# EasyEDA Pro project ProPrj_FOC12_2025-04-03.epro, schematic Schematic2
Board Name: 控制板; Create Date: 2024-12-24; Page Name: P1; Project Name: FOC12; Schematic Name: Schematic2; Update Date: 2025-03-12; Company: 嘉立创EDA; Drawed: Solituder; Page Size: A4; Version: V4.0
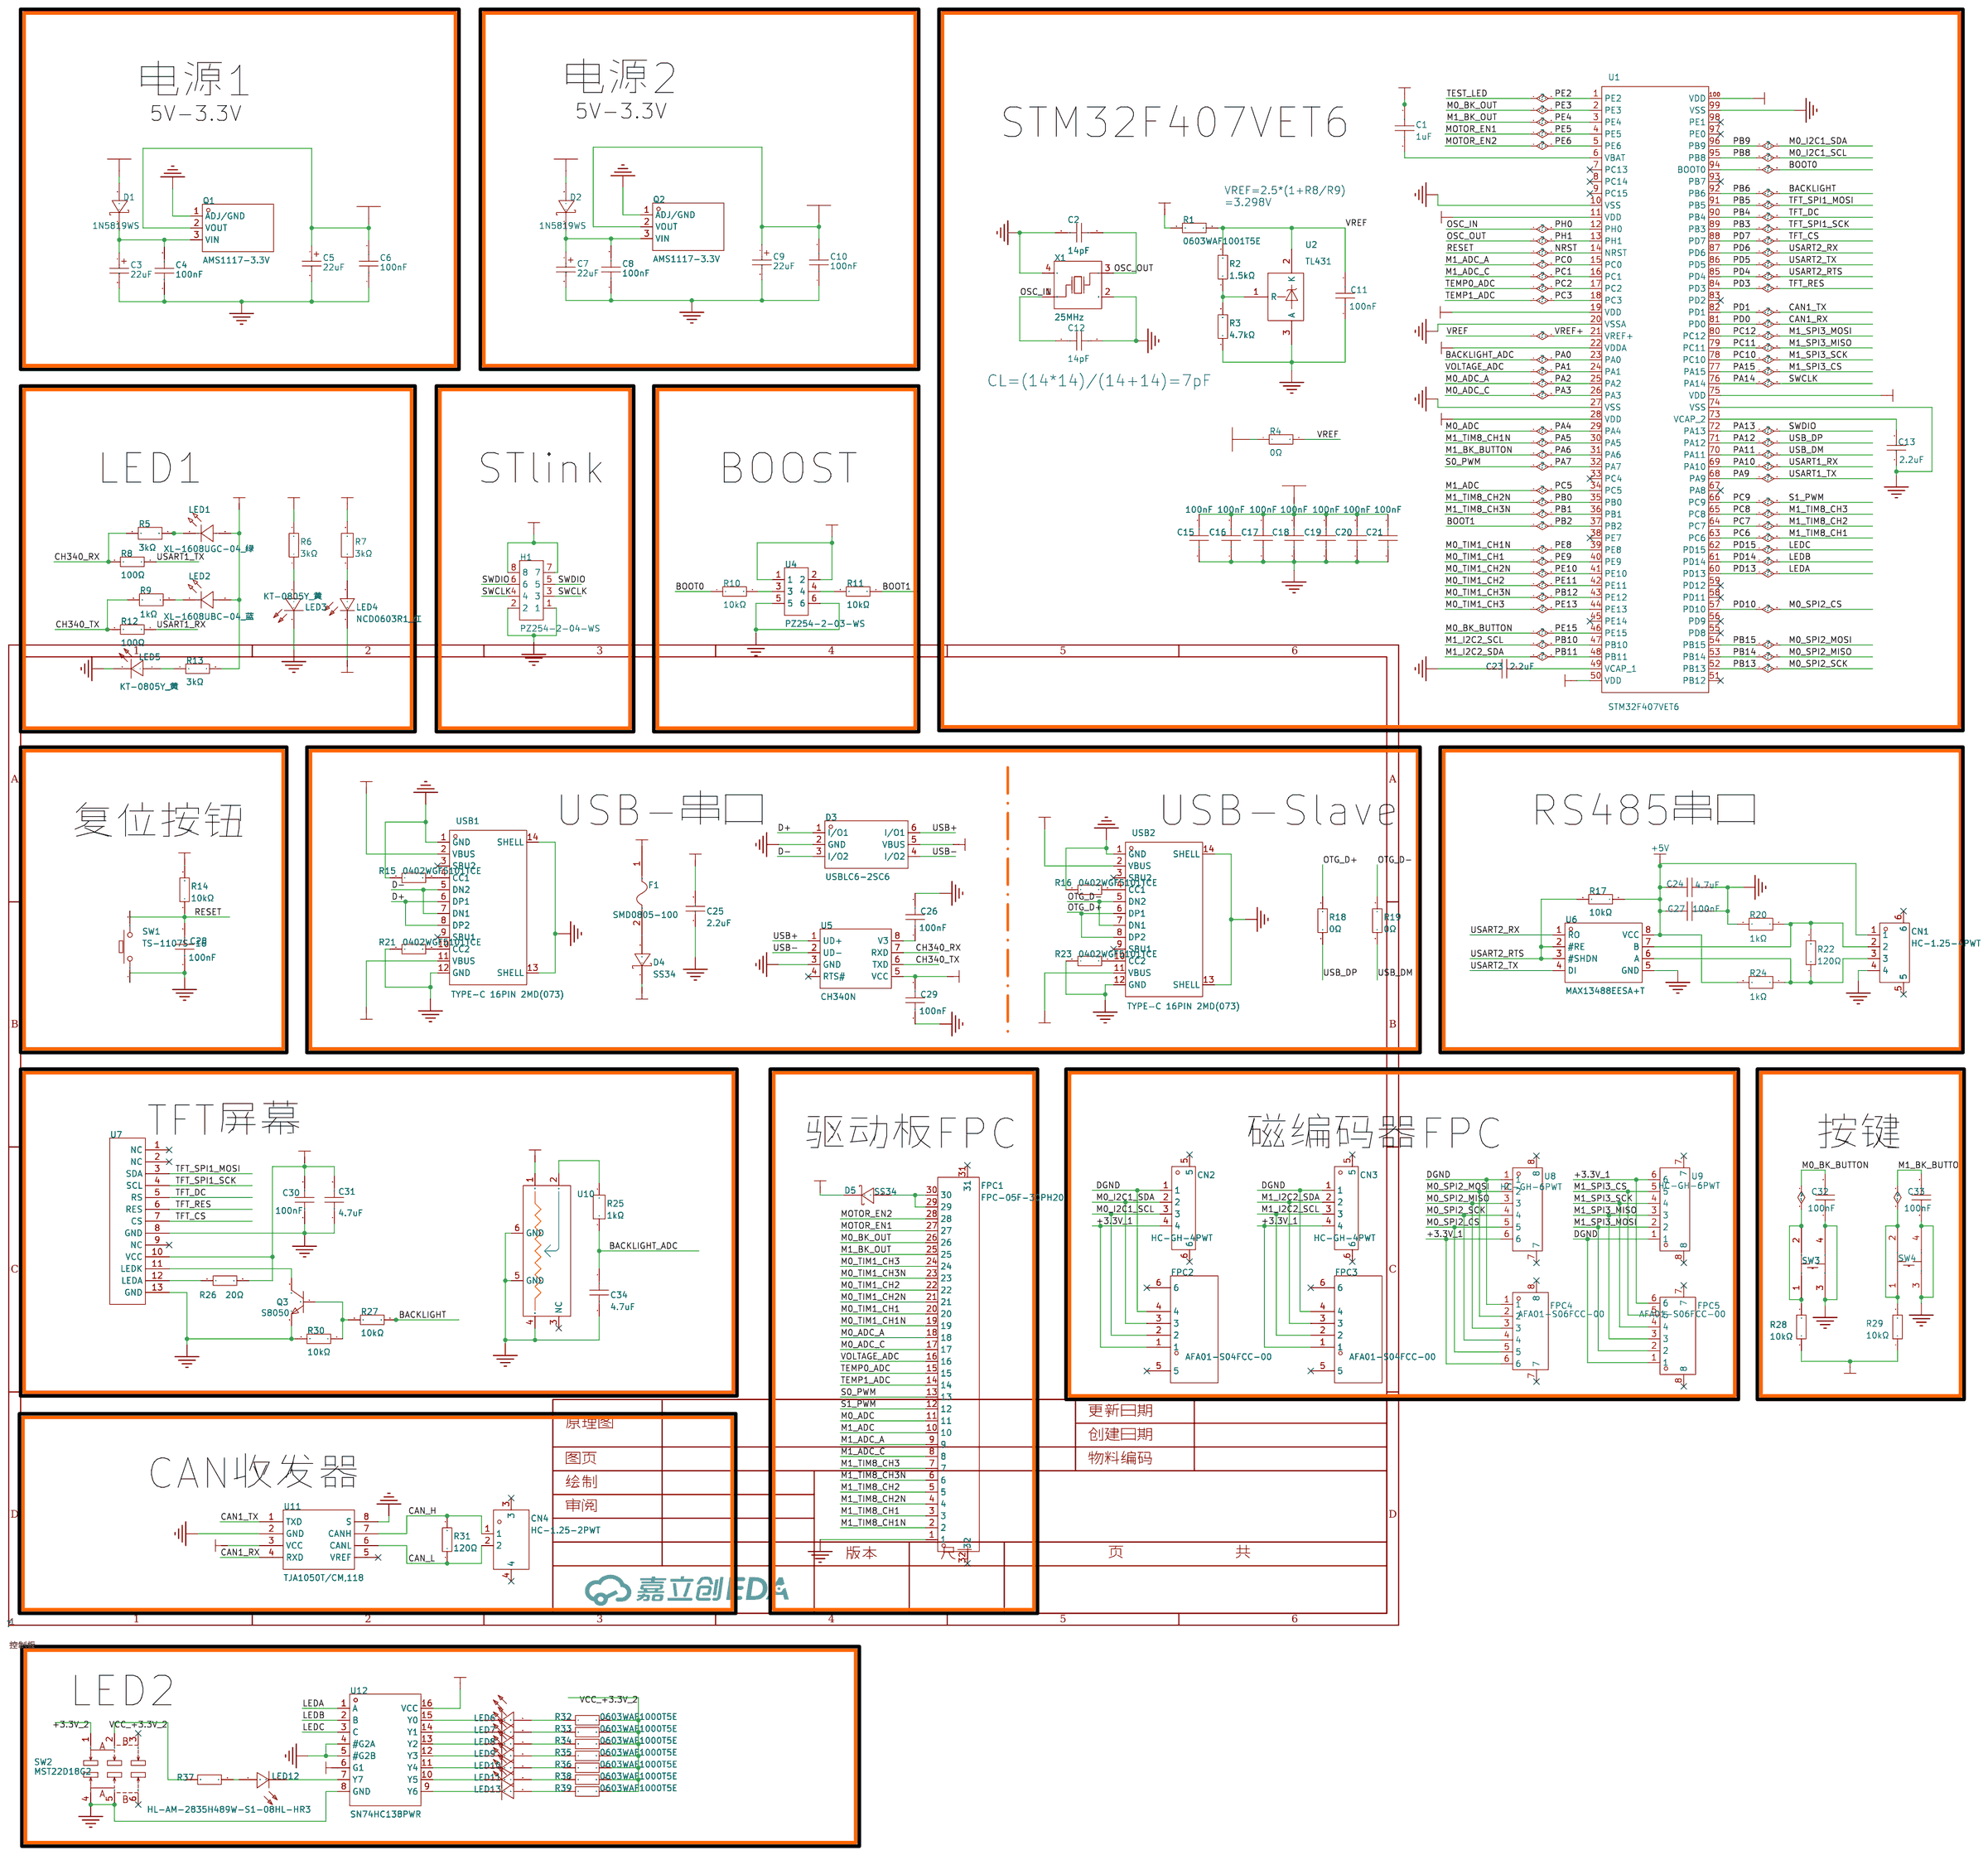
[diagram p1: schematic sheet]

## Parts
C1  1uF  [C0603]
C2  14pF  [C0402]
C3  22uF  [CASE-A_3216]
C4  100nF  [C0603]
C5  22uF  [CASE-A_3216]
C6  100nF  [C0603]
C7  22uF  [CASE-A_3216]
C8  100nF  [C0603]
C9  22uF  [CASE-A_3216]
C10  100nF  [C0603]
C11  100nF  [C0603]
C12  14pF  [C0402]
C13  2.2uF  [C0603]
C15  100nF  [C0603]
C16  100nF  [C0603]
C17  100nF  [C0603]
C18  100nF  [C0603]
C19  100nF  [C0603]
C20  100nF  [C0603]
C21  100nF  [C0603]
C23  2.2uF  [C0603]
C24  4.7uF  [C0603]
C25  2.2uF  [C0603]
C26  100nF  [C0603]
C27  100nF  [C0603]
C28  100nF  [C0603]
C29  100nF  [C0603]
C30  100nF  [C0603]
C31  4.7uF  [C0603]
C32  100nF  [C0603]
C33  100nF  [C0603]
C34  4.7uF  [C0603]
CN1  HC-1.25-4PWT  [CONN-SMD_4P-P1.25-HC-1.25-4PWT]
CN2  HC-GH-4PWT  [CONN-SMD_HC-GH-4PWT]
CN3  HC-GH-4PWT  [CONN-SMD_HC-GH-4PWT]
CN4  HC-1.25-2PWT  [CONN-SMD_2P-P1.25-HC-1.25-2PWT]
D1  1N5819WS  [SOD-323_L1.8-W1.3-LS2.5-RD]
D2  1N5819WS  [SOD-323_L1.8-W1.3-LS2.5-RD]
D3  USBLC6-2SC6  [SOT-23-6_L2.9-W1.6-P0.95-LS2.8-BL]
D4  SS34  [SMA_L4.3-W2.6-LS5.2-RD]
D5  SS34  [SMA_L4.3-W2.6-LS5.2-RD]
F1  SMD0805-100  [F0805]
FPC1  FPC-05F-30PH20  [FPC-SMD_30P-P0.50_XUNPU_FPC-05F-30PH20]
FPC2  AFA01-S04FCC-00  [FPC-SMD_AFA01-S04FCC-00]
FPC3  AFA01-S04FCC-00  [FPC-SMD_AFA01-S04FCC-00]
FPC4  AFA01-S06FCC-00  [FPC-SMD_6P-P1.00_AFA01-S06]
FPC5  AFA01-S06FCC-00  [FPC-SMD_6P-P1.00_AFA01-S06]
H1  PZ254-2-04-WS  [HDR-SMD_8P-P2.54-H-M-R2-C4_2]
LED1  XL-1608UGC-04_绿  [LED0603-RD_GREEN]
LED2  XL-1608UBC-04_蓝  [LED0603-RD_BLUE]
LED3  KT-0805Y_黄  [LED0805-R-RD]
LED4  NCD0603R1_红  [LED0603-RD_RED]
LED5  KT-0805Y_黄  [LED0805-R-RD]
LED6  HL-AM-2835H489W-S1-08HL-HR3  [LED-SMD_L3.3-W2.8-RD]
LED7  HL-AM-2835H489W-S1-08HL-HR3  [LED-SMD_L3.3-W2.8-RD]
LED8  HL-AM-2835H489W-S1-08HL-HR3  [LED-SMD_L3.3-W2.8-RD]
LED9  HL-AM-2835H489W-S1-08HL-HR3  [LED-SMD_L3.3-W2.8-RD]
LED10  HL-AM-2835H489W-S1-08HL-HR3  [LED-SMD_L3.3-W2.8-RD]
LED11  HL-AM-2835H489W-S1-08HL-HR3  [LED-SMD_L3.3-W2.8-RD]
LED12  HL-AM-2835H489W-S1-08HL-HR3  [LED-SMD_L3.3-W2.8-RD]
LED13  HL-AM-2835H489W-S1-08HL-HR3  [LED-SMD_L3.3-W2.8-RD]
Q1  AMS1117-3.3V  [SOT-89-3_L4.5-W2.5-P1.50-LS4.2-BR]
Q2  AMS1117-3.3V  [SOT-89-3_L4.5-W2.5-P1.50-LS4.2-BR]
Q3  S8050  [SOT-23-3_L2.9-W1.3-P1.90-LS2.4-BR]
R1  0603WAF1001T5E  [R0603]
R2  1.5kΩ  [R0603]
R3  4.7kΩ  [R0603]
R4  0Ω  [R0603]
R5  3kΩ  [R0402]
R6  3kΩ  [R0603]
R7  3kΩ  [R0402]
R8  100Ω  [R0402]
R9  1kΩ  [R0402]
R10  10kΩ  [R0402]
R11  10kΩ  [R0402]
R12  100Ω  [R0402]
R13  3kΩ  [R0603]
R14  10kΩ  [R0402]
R15  0402WGF5101TCE  [R0402]
R16  0402WGF5101TCE  [R0402]
R17  10kΩ  [R0402]
R18  0Ω  [R0603]
R19  0Ω  [R0603]
R20  1kΩ  [R0402]
R21  0402WGF5101TCE  [R0402]
R22  120Ω  [R0603]
R23  0402WGF5101TCE  [R0402]
R24  1kΩ  [R0402]
R25  1kΩ  [R0402]
R26  20Ω  [R0402]
R27  10kΩ  [R0402]
R28  10kΩ  [R0402]
R29  10kΩ  [R0402]
R30  10kΩ  [R0402]
R31  120Ω  [R0603]
R32  0603WAF1000T5E  [R0603]
R33  0603WAF1000T5E  [R0603]
R34  0603WAF1000T5E  [R0603]
R35  0603WAF1000T5E  [R0603]
R36  0603WAF1000T5E  [R0603]
R37  0603WAF1000T5E  [R0603]
R38  0603WAF1000T5E  [R0603]
R39  0603WAF1000T5E  [R0603]
SW1  TS-1107S-16  [SW-SMD_L6.0-W3.7-LS8.0]
SW2  MST22D18G2  [SW-SMD_MST22D18G2]
SW3  K2-1808SN-A3SW-01  [椭圆白头按钮开关]
SW4  K2-1808SN-A3SW-01  [椭圆白头按钮开关]
U1  STM32F407VET6  [LQFP-100_L14.0-W14.0-P0.50-LS16.0-BL]
U2  TL431  [SOT-23-3_L2.9-W1.4-P1.90-LS2.6-BR]
U4  PZ254-2-03-WS  [HDR-SMD_6P-P2.54-H-M-R2-C3-LS17.0]
U5  CH340N  [SOP-8_L4.9-W3.9-P1.27-LS6.0-BL]
U6  MAX13488EESA+T  [SOIC-8_L5.0-W4.0-P1.27-LS6.0-BL]
U7  -  [1.14 TFT_13P]
U8  HC-GH-6PWT  [CONN-SMD_6P-P1.25_HCTL_HC-GH-6PWT]
U9  HC-GH-6PWT  [CONN-SMD_6P-P1.25_HCTL_HC-GH-6PWT]
U10  -  [RS08U111Z001]
U11  TJA1050T/CM,118  [SOIC-8_L5.0-W4.0-P1.27-LS6.0-BL]
U12  SN74HC138PWR  [TSSOP-16_L5.0-W4.4-P0.65-LS6.4-BL]
USB1  TYPE-C 16PIN 2MD(073)  [USB-C-SMD_TYPE-C-6PIN-2MD-073]
USB2  TYPE-C 16PIN 2MD(073)  [USB-C-SMD_TYPE-C-6PIN-2MD-073]
X1  25MHz  [CRYSTAL-SMD_4P-L3.2-W2.5-BL]

## Library data of the parts
C1 = CL10A105KB8NNNC: 温度系数:X5R;精度:±10%;额定电压:50V;容值:1uF;; LCSC Part Name: 1uF(105) ±10% 50V; Supplier Part: C15849; Manufacturer: SAMSUNG(三星); Supplier Footprint: 0603; JLCPCB Part Class: Basic Part; Datasheet: https://atta.szlcsc.com/upload/public/pdf/source/20160103/1457707679084.pdf; Supplier: LCSC; Tolerance: ±10%; Voltage Rated: 50V; Temperature Coefficient: X5R
C2 C12 = 0402CG140J500NT: 容值:14pF;精度:±5%;额定电压:50V;材质(温度系数):C0G;; LCSC Part Name: 14pF ±5% 50V; Supplier Part: C3037644; Manufacturer: FH(风华); Supplier Footprint: 0402; JLCPCB Part Class: 扩展库; Datasheet: https://atta.szlcsc.com/upload/public/pdf/source/20200305/C486355_26A10D38EF8C2A5C37091D0039909270.pdf; Supplier: LCSC; Tolerance: ±5%; Voltage Rated: 50V; Temperature Coefficient: C0G
C3 C5 C7 C9 = TAJA226K010RNJ: 容值:22uF;精度:±10%;额定电压:10V;等效串联电阻:3Ω@100kHz;; LCSC Part Name: 22uF ±10% 10V; Supplier Part: C11366; Manufacturer: Kyocera AVX; Supplier Footprint: CASE-A-3216; JLCPCB Part Class: Extended Part; Datasheet: https://atta.szlcsc.com/upload/public/pdf/source/20160107/1457707750344.pdf; Supplier: LCSC; Tolerance: ±10%; Rated Voltage: 10V; Equivalent Series Resistance(ESR): 3Ω@100kHz; Operating Temperature: -55℃~+125℃
C4 C6 C8 C10 C30 = CC0603KRX7R9BB104: 容值:100nF;精度:±10%;额定电压:50V;材质(温度系数):X7R;; LCSC Part Name: 100nF ±10% 50V; Supplier Part: C14663; Manufacturer: YAGEO(国巨); Supplier Footprint: 0603; Datasheet: https://atta.szlcsc.com/upload/public/pdf/source/20170116/1484561234239.pdf; Supplier: LCSC; Tolerance: ±10%; Voltage Rated: 50V; Temperature Coefficient: X7R
C11 C15-C21 C26-C29 C32 C33 = CGA0603X7R104K500JT: 容值:100nF;精度:±10%;额定电压:50V;材质(温度系数):X7R;; LCSC Part Name: 100nF ±10% 50V; Supplier Part: C6119867; Manufacturer: HRE(芯声); Supplier Footprint: 0603; Supplier: LCSC; Tolerance: ±10%; Voltage Rated: 50V; Temperature Coefficient: X7R
C13 C23 C25 = CL10A225KO8NNNC: 温度系数:X5R;容值:2.2uF;精度:±10%;额定电压:16V;; LCSC Part Name: 2.2uF(225) ±10% 16V; Supplier Part: C23630; Manufacturer: SAMSUNG(三星); Supplier Footprint: 0603; JLCPCB Part Class: Basic Part; Datasheet: https://atta.szlcsc.com/upload/public/pdf/source/20160103/1457707709512.pdf; Supplier: LCSC; Tolerance: ±10%; Voltage Rated: 16V; Temperature Coefficient: X5R
C24 C31 C34 = CL10A475KO8NNNC: 容值:4.7uF;精度:±10%;额定电压:16V;材质(温度系数):X5R;; LCSC Part Name: 4.7uF ±10% 16V; Supplier Part: C19666; Manufacturer: SAMSUNG(三星); Supplier Footprint: 0603; JLCPCB Part Class: Basic Part; Datasheet: https://atta.szlcsc.com/upload/public/pdf/source/20160103/1457707703134.pdf; Supplier: LCSC; Tolerance: ±10%; Voltage Rated: 16V; Temperature Coefficient: X5R
CN1 = HC-1.25-4PWT: 插针结构:1x4P;间距:1.25mm;安装方式:卧贴;参考系列:PicoBlade(MX 1.25);总PIN数:4P;排数:1;每排PIN数:4;行距:-;额定电流:1A;触头材质:黄铜;触头镀层:锡;工作温度范围:-40℃~+105℃;; LCSC Part Name: 1x4P 间距:1.25mm 卧贴 系列:PicoBlade(MX 1.25); Supplier Part: C2845381; Manufacturer: HCTL(华灿天禄); Supplier Footprint: SMD,P=1.25mm,卧贴; JLCPCB Part Class: 扩展库; Datasheet: https://atta.szlcsc.com/upload/public/pdf/source/20240930/9508A8292CCC87B0C29E3A028D56E30A.pdf; Supplier: LCSC; Pins Structure: 1x4P; Pitch: 1.25mm; Mounting Style: 卧贴; Reference Series: PicoBlade(MX 1.25); Number of Pins: 4P; Number of Rows: 1; Number of PINs Per Row: 4; Current Rating (Max): 1A; Contact Material: 黄铜; Contact Plating: 锡; Operating Temperature Range: -40℃~+105℃; Rated Voltage (Max): 125V; Plastic Material: LCP; Flame Retardant Rating: UL94V-0; Supplementary Features: 辅助焊脚; Z-Height of the Board: 3.57mm; X-Length of Bottom Edge on Board (Spacing Line): 10.05mm; Y-Width of Bottom Edge on Board: 5.25mm
CN2 CN3 = HC-GH-4PWT_C2845399: 插针结构:1x4P;间距:1.25mm;安装方式:卧贴;参考系列:GH;总PIN数:4P;排数:1;每排PIN数:4;行距:-;额定电流:1A;触头材质:磷青铜;触头镀层:锡;工作温度范围:-25℃~+85℃;; LCSC Part Name: 1x4P 间距:1.25mm 卧贴 系列:GH; Supplier Part: C2845399; Manufacturer: HCTL(华灿天禄); Supplier Footprint: SMD,P=1.25mm,卧贴; JLCPCB Part Class: 扩展库; Datasheet: https://atta.szlcsc.com/upload/public/pdf/source/20231019/68551EBC7AE35D3AC54804DC204EA813.pdf; Supplier: LCSC; Pins Structure: 1x4P; Pitch: 1.25mm; Mounting Style: 卧贴; Reference Series: GH; Number of Pins: 4P; Number of Rows: 1; Number of PINs Per Row: 4; Current Rating (Max): 1A; Contact Material: 磷青铜; Contact Plating: 锡; Operating Temperature Range: -25℃~+85℃; Rated Voltage (Max): 50V; Plastic Material: LCP; Flame Retardant Rating: UL94V-0; Supplementary Features: 辅助焊脚; Z-Height of the Board: 4.25mm; X-Length of Bottom Edge on Board (Spacing Line): 8.25mm
CN4 = HC-1.25-2PWT: 插针结构:1x2P;间距:1.25mm;安装方式:卧贴;参考系列:PicoBlade(MX 1.25);总PIN数:2P;排数:1;每排PIN数:2;行距:-;额定电流:1A;触头材质:黄铜;触头镀层:锡;工作温度范围:-40℃~+105℃;; LCSC Part Name: 1x2P 间距:1.25mm 卧贴 系列:PicoBlade(MX 1.25); Supplier Part: C2845379; Manufacturer: HCTL(华灿天禄); Supplier Footprint: SMD,P=1.25mm,卧贴; JLCPCB Part Class: 扩展库; Datasheet: https://atta.szlcsc.com/upload/public/pdf/source/20240930/9508A8292CCC87B0C29E3A028D56E30A.pdf; Supplier: LCSC; Pins Structure: 1x2P; Pitch: 1.25mm; Mounting Style: 卧贴; Reference Series: PicoBlade(MX 1.25); Number of Pins: 2P; Number of Rows: 1; Number of PINs Per Row: 2; Current Rating (Max): 1A; Contact Material: 黄铜; Contact Plating: 锡; Operating Temperature Range: -40℃~+105℃; Rated Voltage (Max): 125V; Plastic Material: LCP; Flame Retardant Rating: UL94V-0; Supplementary Features: 辅助焊脚; Z-Height of the Board: 3.57mm; X-Length of Bottom Edge on Board (Spacing Line): 7.55mm; Y-Width of Bottom Edge on Board: 5.25mm
D1 D2 = 1N5819WS_C191023: 直流反向耐压(Vr):40V;平均整流电流(Io):1A;正向压降(Vf):600mV@1A;; LCSC Part Name: 40V 1A 600mV@1A; Supplier Part: C191023; Manufacturer: Hottech(合科泰); Supplier Footprint: SOD-323; Datasheet: https://atta.szlcsc.com/upload/public/pdf/source/20180614/C191023_3C6A6398B911F3A4C23E7538EE054643.pdf; Supplier: LCSC; Reverse Voltage (Vr): 40V; Average Rectified Current (Io): 1A; Forward Voltage (Vf@If): 600mV@1A
D3 = USBLC6-2SC6: 最大钳位电压:15V;击穿电压:6V;; Supplier Part: C2687116; Manufacturer: UMW(友台半导体); Supplier Footprint: SOT-23-6; JLCPCB Part Class: 扩展库; Datasheet: https://atta.szlcsc.com/upload/public/pdf/source/20231109/512642D850D9873E7C519F71E85B9A10.pdf; Supplier: LCSC; Maximum Clamping Voltage: 15V; Breakdown Voltage: 6V; Number of Lines: 双路; Type: ESD
D4 D5 = SS34_C8678: 二极管配置:独立式;正向压降(Vf):550mV@3A;直流反向耐压(Vr):40V;整流电流:3A;; LCSC Part Name: 电压:40V 电流:3A; Supplier Part: C8678; Manufacturer: MDD(辰达半导体); Supplier Footprint: SMA(DO-214AC); JLCPCB Part Class: 基础库; Datasheet: https://atta.szlcsc.com/upload/public/pdf/source/20230314/A80AE34493C69B89E2F4B1712F433538.pdf; Supplier: LCSC; Diode Configuration: 独立式; Forward Voltage (Vf@If): 550mV@3A; Reverse Voltage (Vr): 40V; Rectified Current: 3A; Reverse Leakage Current (Ir): 500uA@40V
F1 = SMD0805-100: 最大电压:6V;最大电流:100A;保持电流:1A;跳闸电流:1.95A;; LCSC Part Name: 1A  6V 自恢复保险丝; Supplier Part: C70061; Manufacturer: 台湾陆海; Supplier Footprint: 0805; JLCPCB Part Class: Extended Part; Datasheet: https://atta.szlcsc.com/upload/public/pdf/source/20160331/1459396375879.pdf; Supplier: LCSC; Operating Voltage (Max): 6V; Current Rating (Max): 100A; Hold Current: 1A; Trip Current: 1.95A
FPC1 = FPC-05F-30PH20: 锁定特性:翻盖式;触点类型:下接;触点数量:30P;间距:0.5mm;安装类型:卧贴;工作温度范围:-25℃~+85℃;; LCSC Part Name: 间距:0.5mm P数:30P 翻盖式 下接; Supplier Part: C2856808; Manufacturer: XUNPU(讯普); Supplier Footprint: SMD,P=0.5mm,卧贴; JLCPCB Part Class: 扩展库; Datasheet: https://atta.szlcsc.com/upload/public/pdf/source/20210922/C2856808_4E6DDE2793CFD9EF09B771A8BD3338A4.pdf; Supplier: LCSC; Locking Feature: 翻盖式; Contact Type: 下接; Number of Contacts: 30P; Pitch: 0.5mm; Mounting Type: 卧贴; FFC, FCB Thickness: 0.3mm; Height Above Board: 2mm; Operating Temperature Range: -25℃~+85℃
FPC2 FPC3 = AFA01-S04FCC-00: 间距:1mm;触点数量:4;锁定特性:翻盖式;安装类型:卧贴;触点类型:下接;; LCSC Part Name: 1mm P数:4 翻盖式 下接; Supplier Part: C262381; Manufacturer: JS(钜硕电子); Supplier Footprint: SMD,P=1mm; Datasheet: https://atta.szlcsc.com/upload/public/pdf/source/20180810/C262381_0846EB3FDC52B56B2A83F750690C3963.pdf; Supplier: LCSC; Pitch: 1mm; Number of Contacts: 4; Locking Feature: 翻盖式; Mounting Type: 卧贴; Contact Type: 下接; Height Above Board: 2mm; FFC, FCB Thickness: 0.3mm
FPC4 FPC5 = AFA01-S06FCC-00: 间距:1mm;触点数量:6;锁定特性:翻盖式;安装类型:卧贴;触点类型:下接;; LCSC Part Name: 1mm P数:6 翻盖式 下接; Supplier Part: C262383; Manufacturer: JS(钜硕电子); Supplier Footprint: SMD,P=1mm; JLCPCB Part Class: Extended Part; Datasheet: https://atta.szlcsc.com/upload/public/pdf/source/20180814/C262383_CF97819C579FC3B5207D9C4D84E357C3.pdf; Supplier: LCSC; Locking Feature: 翻盖式; Contact Type: 下接; Number of Contacts: 6; Pitch: 1mm; Mounting Type: 卧贴; FFC, FCB Thickness: 0.3mm; Height Above Board: 2mm
H1 = PZ254-2-04-WS: 插针结构:2x4P;间距:2.54mm;行距:2.54mm;圆针/方针:方针;安装类型:卧贴;排数:双排;总PIN位数:8P;额定电流:3A;额定电压:-;配合针长度:6mm;塑高:2.5mm;端接针长度:-;工作温度范围:-40℃~+105℃;焊接温度(最大值):260℃@10S;颜色:黑色;; LCSC Part Name: 2x4P 间距:2.54mm 方针 卧贴 黑色; Supplier Part: C5149354; Manufacturer: HCTL(华灿天禄); Supplier Footprint: SMD,P=2.54mm; JLCPCB Part Class: 扩展库; Datasheet: https://atta.szlcsc.com/upload/public/pdf/source/20230609/395CF6299CB3DEE695290492722C7F5B.pdf; Supplier: LCSC; Pin Structure: 2x4P; Pitch: 2.54mm; Row Spacing: 2.54mm; Circluar Pins/Square Pins: 方针; Mounting Type: 卧贴; Number of Rows: 双排; Number of Pins: 8P; Current Rating (Max): 3A; Length of Mating Pin: 6mm; Insulation Height: 2.5mm; Operating Temperature Range: -40℃~+105℃; Soldering Temperature(Max): 260℃@10S; Color: 黑色
LED1 = XL-1608UGC-04: 灯头类型:-;发光颜色:翠绿色;正向电压(VF):-;功率:80mW;正向电流:25mA;主波长:516nm~525nm;二极管配置:独立二极管;透镜颜色:无色透明透镜;色温:-;发光强度:-;发光角度:120°;载带方式:正贴;工作温度:-30℃~+85℃;; Supplier Part: C965804; Manufacturer: XINGLIGHT(成兴光); Supplier Footprint: 0603; JLCPCB Part Class: 扩展库; Datasheet: https://atta.szlcsc.com/upload/public/pdf/source/20221102/520D6E465E5CFD1609C8A4DBC80D4018.pdf; Supplier: LCSC; Emitted Color: 翠绿色; Power Dissipation: 80mW; Forward Current: 25mA; Dominant Wavelength: 516nm~525nm; Peak Wavelength: 534nm; Diode Configuration: 独立二极管; Lens Color: 无色透明透镜; Viewing Angle: 120°; Mounting Sytle: 正贴; Operating Temperature: -30℃~+85℃
LED2 = XL-1608UBC-04: 发光颜色:蓝色;功率:80mW;正向电流:25mA;主波长:460nm~469nm;透镜颜色:无色透明透镜;色温:-;发光角度:120°;载带方式:正贴;工作温度:-30℃~+85℃;; Supplier Part: C965807; Manufacturer: XINGLIGHT(成兴光); Supplier Footprint: 0603; JLCPCB Part Class: 扩展库; Datasheet: https://atta.szlcsc.com/upload/public/pdf/source/20240218/F76B043D1CDACE9DB8357580572EF0D5.pdf; Supplier: LCSC; Emitted Color: 蓝色; Power Dissipation: 80mW; Forward Current: 25mA; Dominant Wavelength: 460nm~469nm; Peak Wavelength: 475nm; Lens Color: 无色透明透镜; Viewing Angle: 120°; Mounting Sytle: 正贴; Operating Temperature: -30℃~+85℃
LED3 LED5 = KT-0805Y: 发光颜色:黄色;功率:-;正向电流:-;主波长:-;二极管配置:-;透镜颜色:-;色温:-;发光角度:-;载带方式:-;工作温度:-;; LCSC Part Name: 0805 黄灯 高亮; Supplier Part: C2296; Manufacturer: KENTO; Supplier Footprint: 0805; JLCPCB Part Class: Basic Part; Datasheet: https://atta.szlcsc.com/upload/public/pdf/source/20160421/1461205044170.pdf; Supplier: LCSC; Emitted Color: 黄色
LED4 = NCD0603R1_C84263: 灯头类型:-;发光颜色:红色;正向压降(Vf):1.6V~2.6V;功率:65mW;正向电流:25mA;波长:615nm~630nm;二极管配置:独立二极管;透镜颜色:-;色温:-;发光强度:80mcd~220mcd;发光角度:130°;载带方式:-;工作温度:-30℃~+85℃;; LCSC Part Name: NCD0603R1; Supplier Part: C84263; Manufacturer: 国星光电; Supplier Footprint: 0603; JLCPCB Part Class: Extended Part; Datasheet: https://atta.szlcsc.com/upload/public/pdf/source/20200820/C84263_DABC6A75E58F576973B407FDBA283D60.pdf; Supplier: LCSC; Forward Current: 25mA; Diode Configuration: 独立二极管; Luminous Intensity: 80mcd~220mcd; Viewing Angle: 130°; Operating Temperature: -30℃~+85℃; Illumination Color: 红色; Voltage - Forward(Vf): 1.6V~2.6V; Power(Watts): 65mW; Wavelength - Dominant: 615nm~630nm
LED6-LED13 = HL-AM-2835H489W-S1-08HL-HR3: 发光颜色:白灯;二极管配置:-;透镜颜色:-;主波长:-;峰值波长:-;色温:2800K~3100K;光通量(25℃时):-;测试电流:-;正向电压(VF):-;发光强度:-;功率:-;发光角度:-;安装方式:正贴;工作温度:-;; LCSC Part Name: 白灯 2800K~3100K 正贴; Supplier Part: C210310; Manufacturer: HONGLITRONIC(鸿利光电); Supplier Footprint: 2835(mm); JLCPCB Part Class: Extended Part; Datasheet: https://atta.szlcsc.com/upload/public/pdf/source/20200909/C210311_665F1F7249D0499297E45CA2E817FB65.pdf; Supplier: LCSC; Emitted Color: 白灯; Color Temperature: 2800K~3100K; Mounting Sytle: 正贴
Q1 Q2 = AMS1117-3.3V_C5120796: 输出类型:固定;最大输入电压:18V;输出电压:3.3V;最大输出电流:1A;输出极性:正极;; LCSC Part Name: 输入18V 输出3.3V 1A; Supplier Part: C5120796; Manufacturer: MSKSEMI(美森科); Supplier Footprint: SOT-89; Datasheet: https://atta.szlcsc.com/upload/public/pdf/source/20220727/5E62EAC46FFFF83337622C0FBE1B6BF8.pdf; Supplier: LCSC; Output Type: 固定; Maximum Input Voltage: 18V; Output Voltage: 3.3V; MAX Output Current: 1A; Dropout Voltage: 1.4V@(1A); standby current: 12mA; Operating Temperature: 0℃~+125℃; Output Polarity: 正极; Number of Outputs: 1
Q3 = S8050: NPN 25V 500mA 120-400 SOT-23; Supplier Part: C2931719; Manufacturer: Doeshare(德芯); Supplier Footprint: SOT-23; Datasheet: https://atta.szlcsc.com/upload/public/pdf/source/20220117/E6D3315E0D6ADDB25840BFFAC039C5C0.pdf; Supplier: LCSC
R1 = 0603WAF1001T5E: LCSC Part Name: 1KΩ(1001) ±1% 编带; Supplier Part: C21190; Manufacturer: UNI-ROYAL(厚声); Supplier Footprint: 0603; JLCPCB Part Class: Basic Part; Datasheet: https://atta.szlcsc.com/upload/public/pdf/source/20170920/C21190_1505887441885980538.pdf; Supplier: LCSC
R2 = 0603WAF1501T5E: 阻值:1.5kΩ;精度:±1%;温度系数:±100ppm/℃;功率:1/10W;最大工作电压:75V;工作温度范围:-55℃~+155℃;; LCSC Part Name: 1.5KΩ ±1%; Supplier Part: C22843; Manufacturer: UNI-ROYAL(厚声); Supplier Footprint: 0603; JLCPCB Part Class: Basic Part; Datasheet: https://atta.szlcsc.com/upload/public/pdf/source/20170920/C22843_1505887489783980640.pdf; Supplier: LCSC; Tolerance: ±1%; Power(Watts): 1/10W; Overload Voltage (Max): 75V; Temperature Coefficient: ±100ppm/℃; Operating Temperature Range: -55℃~+155℃
R3 = RC0603FR-074K7L: 精度:±1%;阻值:4.7kΩ;温度系数:±100ppm/℃;功率:100mW;最大工作电压:75V;工作温度范围:-55℃~+155℃;; LCSC Part Name: 4.7kΩ ±1%; Supplier Part: C99782; Manufacturer: YAGEO(国巨); Supplier Footprint: 0603; JLCPCB Part Class: Extended Part; Datasheet: https://atta.szlcsc.com/upload/public/pdf/source/20171030/C99782_15093665213961068236.pdf; Supplier: LCSC; Tolerance: ±1%; Power(Watts): 100mW; Overload Voltage (Max): 75V; Temperature Coefficient: ±100ppm/℃; Operating Temperature Range: -55℃~+155℃
R4 R18 R19 = 0603WAF0000T5E: 温度系数:-;精度:±1%;阻值:0Ω;功率:1/10W;最大工作电压:75V;工作温度范围:-55℃~+155℃;; LCSC Part Name: 0Ω ±1%; Supplier Part: C21189; Manufacturer: UNI-ROYAL(厚声); Supplier Footprint: 0603; Datasheet: https://atta.szlcsc.com/upload/public/pdf/source/20170920/C21189_1505887441435980537.pdf; Supplier: LCSC; Tolerance: ±1%; Power(Watts): 1/10W; Overload Voltage (Max): 75V; Operating Temperature Range: -55℃~+155℃
R5 R7 = FRC0402F3001TS: 电阻类型:厚膜电阻;阻值:3kΩ;精度:±1%;功率:62.5mW;最大工作电压:50V;温度系数:±100ppm/℃;; LCSC Part Name: 3kΩ ±1% 62.5mW 厚膜电阻; Supplier Part: C2909355; Manufacturer: FOJAN(富捷); Supplier Footprint: 0402; Datasheet: https://atta.szlcsc.com/upload/public/pdf/source/20211221/925EC7D7225764EE0046F22065062C87.pdf; Supplier: LCSC; Type: 厚膜电阻; Tolerance: ±1%; Power(Watts): 62.5mW; Overload Voltage (Max): 50V; Temperature Coefficient: ±100ppm/℃; Operating Temperature Range: -55℃~+155℃
R6 R13 = 0603WAF3001T5E: 电阻类型:厚膜电阻;阻值:3kΩ;精度:±1%;功率:100mW;最大工作电压:75V;温度系数:±100ppm/℃;; LCSC Part Name: 3kΩ ±1% 100mW 厚膜电阻; Supplier Part: C4211; Manufacturer: UNI-ROYAL(厚声); Supplier Footprint: 0603; JLCPCB Part Class: 基础库; Datasheet: https://atta.szlcsc.com/upload/public/pdf/source/20200306/C422600_1E6D84923E4A46A82E41ADD87F860B5C.pdf; Supplier: LCSC; Type: 厚膜电阻; Tolerance: ±1%; Power(Watts): 100mW; Overload Voltage (Max): 75V; Temperature Coefficient: ±100ppm/℃; Operating Temperature Range: -55℃~+155℃
R8 R12 = 0402WGF1000TCE: 电阻类型:厚膜电阻;阻值:100Ω;精度:±1%;功率:1/16W;温度系数:±200ppm/℃;最大工作电压:50V;工作温度范围:-55℃~+155℃;; LCSC Part Name: 100Ω ±1% 1/16W; Supplier Part: C25076; Manufacturer: UNI-ROYAL(厚声); Supplier Footprint: 0402; JLCPCB Part Class: Basic Part; Datasheet: https://atta.szlcsc.com/upload/public/pdf/source/20200306/C422600_1E6D84923E4A46A82E41ADD87F860B5C.pdf; Supplier: LCSC; Type: 厚膜电阻; Tolerance: ±1%; Power(Watts): 1/16W; Overload Voltage (Max): 50V; Temperature Coefficient: ±200ppm/℃; Operating Temperature Range: -55℃~+155℃
R9 R20 R24 R25 = FRC0402J102 TS: 电阻类型:厚膜电阻;阻值:1kΩ;精度:±5%;功率:62.5mW;最大工作电压:50V;温度系数:±100ppm/℃;; LCSC Part Name: 1kΩ ±5% 62.5mW 厚膜电阻; Supplier Part: C2906899; Manufacturer: FOJAN(富捷); Supplier Footprint: 0402; JLCPCB Part Class: 扩展库; Datasheet: https://atta.szlcsc.com/upload/public/pdf/source/20211221/925EC7D7225764EE0046F22065062C87.pdf; Supplier: LCSC; Type: 厚膜电阻; Tolerance: ±5%; Power(Watts): 62.5mW; Overload Voltage (Max): 50V; Temperature Coefficient: ±100ppm/℃; Operating Temperature Range: -55℃~+155℃
R10 R11 R14 R17 R27-R30 = 0402WGF1002TCE: 电阻类型:厚膜电阻;阻值:10kΩ;精度:±1%;功率:62.5mW;温度系数:±100ppm/℃;最大工作电压:50V;工作温度范围:-55℃~+155℃;; LCSC Part Name: 10kΩ ±1% 62.5mW; Supplier Part: C25744; Manufacturer: UNI-ROYAL(厚声); Supplier Footprint: 0402; JLCPCB Part Class: Basic Part; Datasheet: https://atta.szlcsc.com/upload/public/pdf/source/20200306/C422600_1E6D84923E4A46A82E41ADD87F860B5C.pdf; Supplier: LCSC; Type: 厚膜电阻; Tolerance: ±1%; Power(Watts): 62.5mW; Overload Voltage (Max): 50V; Temperature Coefficient: ±100ppm/℃; Operating Temperature Range: -55℃~+155℃
R15 R16 R21 R23 = 0402WGF5101TCE: LCSC Part Name: 5.1KΩ(5101) ±1% 编带; Supplier Part: C25905; Manufacturer: UNI-ROYAL(厚声); Supplier Footprint: 0402; JLCPCB Part Class: Basic Part; Datasheet: https://atta.szlcsc.com/upload/public/pdf/source/20170920/C25905_1505895107382980911.pdf; Supplier: LCSC
R22 R31 = 0603WAF1200T5E: 电阻类型:厚膜电阻;阻值:120Ω;精度:±1%;功率:100mW;温度系数:±100ppm/℃;最大工作电压:75V;工作温度范围:-55℃~+155℃;; LCSC Part Name: 120Ω ±1% 100mW; Supplier Part: C22787; Manufacturer: UNI-ROYAL(厚声); Supplier Footprint: 0603; JLCPCB Part Class: Basic Part; Datasheet: https://atta.szlcsc.com/upload/public/pdf/source/20200306/C422600_1E6D84923E4A46A82E41ADD87F860B5C.pdf; Supplier: LCSC; Type: 厚膜电阻; Tolerance: ±1%; Power(Watts): 100mW; Overload Voltage (Max): 75V; Temperature Coefficient: ±100ppm/℃; Operating Temperature Range: -55℃~+155℃
R26 = 0402WGF200JTCE: 电阻类型:厚膜电阻;阻值:20Ω;精度:±1%;功率:62.5mW;温度系数:±200ppm/℃;最大工作电压:50V;工作温度范围:-55℃~+155℃;; LCSC Part Name: 20Ω ±1% 62.5mW; Supplier Part: C25089; Manufacturer: UNI-ROYAL(厚声); Supplier Footprint: 0402; JLCPCB Part Class: Extended Part; Datasheet: https://atta.szlcsc.com/upload/public/pdf/source/20200306/C422600_1E6D84923E4A46A82E41ADD87F860B5C.pdf; Supplier: LCSC; Type: 厚膜电阻; Tolerance: ±1%; Power(Watts): 62.5mW; Overload Voltage (Max): 50V; Temperature Coefficient: ±200ppm/℃; Operating Temperature Range: -55℃~+155℃
R32-R39 = 0603WAF1000T5E: LCSC Part Name: 100Ω(1000) ±1% 编带; Supplier Part: C22775; Manufacturer: UNI-ROYAL(厚声); Supplier Footprint: 0603; JLCPCB Part Class: Basic Part; Datasheet: https://atta.szlcsc.com/upload/public/pdf/source/20170920/C22775_1505887458160980573.pdf; Supplier: LCSC
SW1 = TS-1107S-16: 电路结构:单刀单掷;按钮形状:矩形按钮;作用力:1.6N;安装方式:立贴;开关长度:6mm;开关宽度:3mm;开关高度:2.6mm;触点电流:25mA;额定电压(DC):24V;带灯:-;机械寿命:6.5万次;; LCSC Part Name: 6*3*2.6mm 立贴 轻触开关; Supplier Part: C428471; Manufacturer: SOFNG(硕方); Supplier Footprint: SMD; JLCPCB Part Class: 扩展库; Datasheet: https://atta.szlcsc.com/upload/public/pdf/source/20190912/C428471_E3495014A47C52F84E03620F77FB889A.pdf; Supplier: LCSC; Circuit: 单刀单掷; Actuator Style: 矩形按钮; Operating Force: 1.6N; Mounting Style: 立贴; Switch Length: 6mm; Switch Width: 3mm; Switch Height: 2.6mm; Contact Current: 25mA; Voltage Rating (DC): 24V; Actuator/Cap Color: 红色; Mechanical Life: 6.5万次; Operating Temperature: -40℃~+85℃
SW2 = MST22D18G2: 电路结构:双刀双掷;安装方式:立贴;开关颜色:-;额定电流(DC):50mA;额定电压(DC):12V;额定电流(AC):-;额定电压(AC):-;机械寿命:1万次;; LCSC Part Name: 两档立式贴片 6脚拨动 柄长2.0MM; Supplier Part: C431544; Manufacturer: SHOU HAN(首韩); Supplier Footprint: SMD,3.6x9.1mm; Datasheet: https://atta.szlcsc.com/upload/public/pdf/source/20190925/C431544_D32DFFD935A96A6C5145903882D4ABA1.pdf; Supplier: LCSC; Circuit: 双刀双掷; Pin Style: SMD接片; Switch Length: 9.1mm; Switch Width: 3.6mm; Switch Height: 3.45mm; Mounting Style: 立贴; Current Rating (DC): 50mA; Voltage Rating (DC): 12V; Mechanical Life: 1万次; Operating Temperature: -30℃~+80℃
SW3 SW4 = K2-1808SN-A3SW-01: 触点电流:50mA;额定电压(DC):12V;绝缘电阻:100MΩ;安装方式:立贴;作用力:180gf@±30gf;机械寿命:100000;工作温度:-25~+85;开关长度:4.2mm;开关宽度:3.25mm;开关高度:2.5mm;; LCSC Part Name: 3*4*2.5 贴片开关180G; Supplier Part: C2690012; Manufacturer: 韩国韩荣; Supplier Footprint: SMD; JLCPCB Part Class: Extended Part; Datasheet: https://atta.szlcsc.com/upload/public/pdf/source/20180927/C283535_7E7907F3E7B6C1691E1DC87E363D082A.pdf; Supplier: LCSC; Contact Current: 50mA; Voltage Rating (DC): 12V; Insulation Resistance: 100MΩ; Mounting Style: 立贴; Operating Force: 180gf@±30gf; Mechanical Life: 100000; Operating Temperature: -25~+85; Switch Length: 4.2mm; Switch Width: 3.25mm; Switch Height: 2.5mm
U1 = STM32F407VGT6: CPU内核:ARM-M4;程序存储容量:1MB;RAM总容量:192KB;GPIO端口数量:82;工作电压范围:1.8V~3.6V;CPU最大主频:168MHz;程序存储器类型:FLASH;; LCSC Part Name: 带DSP和FPU的高性能基础系列ARM Cortex-M4 MCU，具有1 MB Flash、168 MHz CPU、ART加速器、以太网和FSMC; Supplier Part: C12345; Manufacturer: ST(意法半导体); Supplier Footprint: LQFP-100(14x14); JLCPCB Part Class: 扩展库; Datasheet: https://atta.szlcsc.com/upload/public/pdf/source/20201130/C919362_39400D478C258148B3DF984CE4A4041A.pdf; Supplier: LCSC; CPU Core: ARM-M4; Program Storage Size: 1MB; RAM Size: 192KB; GPIO Ports Number: 82; Operating Voltage Range: 1.8V~3.6V; CPU Maximum Speed: 168MHz; Program Memory Type: FLASH; Operating Temperature Range: -40℃~+85℃; ADC (Bit): 12bit; DAC (Bit): 12bit; Universal Serial Bus: 有; Peripheral/Function: DMA；LCD/LED驱动; Watchdog: 有; Infrared Data Association: 有; Low-Voltage Detect: 有; LCD Module: 有; Direct Memory Access: 有; Internal Oscillator: 有
U2 = TL431_C963380: 输出类型:可调;输入电压:37V;输出电压:2.5V~36V;输出电流:-;精度:-;; Supplier Part: C963380; Manufacturer: JSMSEMI(杰盛微); Supplier Footprint: SOT-23; Datasheet: https://atta.szlcsc.com/upload/public/pdf/source/20230807/EF0970E00E6F0FAFB24359B08B49660E.pdf; Supplier: LCSC; Output Type: 可调; Input Voltage: 37V; Output Voltage: 2.5V~36V; Temperature Coefficient: 50ppm/℃; Reference Type: 并联; Minimum Cathode Current for Regulation: 1mA; Dynamic Impedance: 150mΩ; Operating Temperature: -25℃~+85℃
U4 = PZ254-2-03-WS: 插针结构:2x3P;间距:2.54mm;行距:2.54mm;圆针/方针:方针;安装类型:卧贴;排数:双排;总PIN位数:6P;额定电流:3A;额定电压:-;配合针长度:6mm;塑高:2.5mm;端接针长度:-;工作温度范围:-40℃~+105℃;焊接温度(最大值):260℃@10S;颜色:黑色;; LCSC Part Name: 2x3P 间距:2.54mm 方针 卧贴 黑色; Supplier Part: C5149353; Manufacturer: HCTL(华灿天禄); Supplier Footprint: SMD,P=2.54mm,卧贴; JLCPCB Part Class: 扩展库; Datasheet: https://atta.szlcsc.com/upload/public/pdf/source/20230609/395CF6299CB3DEE695290492722C7F5B.pdf; Supplier: LCSC; Pin Structure: 2x3P; Pitch: 2.54mm; Row Spacing: 2.54mm; Circluar Pins/Square Pins: 方针; Mounting Type: 卧贴; Number of Rows: 双排; Number of Pins: 6P; Current Rating (Max): 3A; Length of Mating Pin: 6mm; Insulation Height: 2.5mm; Operating Temperature Range: -40℃~+105℃; Soldering Temperature(Max): 260℃@10S; Color: 黑色
U5 = CH340N: 应用功能:USB转串口;接口协议:USB 2.0;通道数:1;数据速率:2Mbps;; LCSC Part Name: USB转串口芯片CH340; Supplier Part: C2977777; Manufacturer: WCH(南京沁恒); Supplier Footprint: SOP-8; JLCPCB Part Class: 扩展库; Datasheet: https://atta.szlcsc.com/upload/public/pdf/source/20240313/115CDE92081B1D6CB446704AD5D0F5F2.pdf; Supplier: LCSC; Applications Function: USB转串口; Protocol: USB 2.0; Number of Channels: 1; Supply Voltage: 3.3V；5V; Data Rate: 2Mbps; Operating Temperature: -20℃~+70℃
U6 = MAX13488EESA+T: 类型:收发器;驱动器/接收器:1/1;数据速率:16Mbps;; LCSC Part Name: 5V供电 16Mbps 收发器; Supplier Part: C156258; Manufacturer: ADI(亚德诺)/MAXIM(美信); Supplier Footprint: SOIC-8; JLCPCB Part Class: Extended Part; Datasheet: https://atta.szlcsc.com/upload/public/pdf/source/20171202/C156258_15122106256341160224.pdf; Supplier: LCSC; Types: 收发器; Driver/receiver: 1/1; Data Rate: 16Mbps; Supply Voltage: 4.75V~5.25V
U7 = 1.14 TFT_13P
U8 U9 = HC-GH-6PWT: 插针结构:1x6P;间距:1.25mm;安装方式:卧贴;参考系列:GH;总PIN数:6P;排数:1;每排PIN数:6;行距:-;额定电流:1A;触头材质:磷青铜;触头镀层:锡;工作温度范围:-25℃~+85℃;; LCSC Part Name: 1x6P 间距:1.25mm 卧贴 系列:GH; Supplier Part: C3011948; Manufacturer: HCTL(华灿天禄); Supplier Footprint: SMD,P=1.25mm,卧贴; JLCPCB Part Class: 扩展库; Datasheet: https://atta.szlcsc.com/upload/public/pdf/source/20210728/C2845397_2BAB5616F3DD52263F1EF5392BF0F2D4.pdf; Supplier: LCSC; Pins Structure: 1x6P; Pitch: 1.25mm; Mounting Style: 卧贴; Reference Series: GH; Number of Pins: 6P; Number of Rows: 1; Number of PINs Per Row: 6; Current Rating (Max): 1A; Contact Material: 磷青铜; Contact Plating: 锡; Operating Temperature Range: -25℃~+85℃; Rated Voltage (Max): 50V; Plastic Material: LCP; Flame Retardant Rating: UL94V-0; Supplementary Features: 辅助焊脚; Z-Height of the Board: 4.25mm; X-Length of Bottom Edge on Board (Spacing Line): 10.75mm
U10 = RS08U111Z001: 滑动电位器; Part Code: C202411; Resistance: 10K; Manufacturer: ALPSALPINE(阿尔卑斯阿尔派)
U11 = TJA1050T/CM,118: 类型:收发器;协议类别:CAN总线;; Supplier Part: C6952; Manufacturer: NXP(恩智浦); Supplier Footprint: SOIC-8_150mil; JLCPCB Part Class: Basic Part; Datasheet: https://atta.szlcsc.com/upload/public/pdf/source/20140411/1457707042917.pdf; Supplier: LCSC; Type: 收发器; Supply Voltage: 4.75V ~ 5.25V; Protocol: CAN总线
U12 = SN74HC138PWR: SN74HC138 3 线路至 8 线路解码器/多路解复用器; Supplier Part: C157527; Manufacturer: TI(德州仪器); Supplier Footprint: TSSOP-16; JLCPCB Part Class: Extended Part; Datasheet: https://atta.szlcsc.com/upload/public/pdf/source/20180111/C157527_15156541962221258607.pdf; Supplier: LCSC
USB1 USB2 = TYPE-C 16PIN 2MD(073): 连接器类型:Type-C;标准:-;公母:母;端口数量:1;触点数量:16P;安装方式:卧贴;额定电流 - 电源:5A;工作温度范围:-25℃~+85℃;; LCSC Part Name: Type-C 母 卧贴; Supplier Part: C2765186; Manufacturer: SHOU HAN(首韩); Supplier Footprint: SMD; JLCPCB Part Class: 扩展库; Datasheet: https://atta.szlcsc.com/upload/public/pdf/source/20211123/39B17C16241EAC15C5E277BDA434118E.pdf; Supplier: LCSC; Connector Type: Type-C; Gender: 母; Number of Ports: 1; Number of Contacts: 16P; Mounting Style: 卧贴; Current Rating - Power (Max): 5A; Operating Temperature Range: -25℃~+85℃
X1 = X322525MOB4SI: 晶振类型:贴片晶振;频率:25MHz;常温频差:±10ppm;负载电容:12pF;频率稳定度(全温):±20ppm;; LCSC Part Name: 25MHz ±10ppm 12pF; Supplier Part: C9006; Manufacturer: YXC(扬兴晶振); Supplier Footprint: SMD3225-4P; JLCPCB Part Class: 基础库; Datasheet: https://atta.szlcsc.com/upload/public/pdf/source/20240329/19D5F850207469550BEB00D7DFEDBC7A.pdf; Supplier: LCSC; Crystal Type: 贴片晶振; Normal temperature Frequency Tolerance: ±10ppm; Load Capacitor: 12pF; Frequency Stability(Full temperature range): ±20ppm; Operating Temperature: -40℃~+85℃

## Nets
+3.3V_1: C1.1 C5.1 C6.2 C15.2 C16.2 C17.2 C18.2 C19.2 C20.2 C21.2 CN2.4 CN3.4 FPC2.1 FPC3.1 FPC4.6 FPC5.6 H1.7 H1.8 LED1.2(A) LED2.2(A) Q1.2(VOUT) R4.1 R7.2 R13.2 R14.2 R28.1 R29.1 U1.11(VDD) U1.19(VDD) U1.22(VDDA) U1.28(VDD) U1.50(VDD) U1.75(VDD) U1.100(VDD) U4.1 U4.2 U8.6 U9.6
+3.3V_2: C9.1 C10.2 C30.2 C31.2 Q2.2(VOUT) R6.2 R26.2 SW2.1 U7.10(VCC) U10.1(V/G)
+5V: C24.2 C25.2 C27.2 C29.2 CN1.1 D1.2(A) D2.2(A) D3.5(VBUS) D4.1(K) D5.1(K) R1.1 R17.1 R24.2 U5.5(VCC) U6.8(VCC) U11.3(VCC) U12.6(G1) U12.16(VCC)
DGND: C2.2 C3.2 C4.1 C5.2 C6.1 C7.2 C8.1 C9.2 C10.1 C11.1 C12.2 C13.1 C15.1 C16.1 C17.1 C18.1 C19.1 C20.1 C21.1 C23.1 C24.1 C25.1 C26.2 C27.1 C28.1 C29.1 C30.1 C31.1 C32.1 C33.1 C34.2 CN1.4 CN2.1 CN3.1 D3.2(GND) FPC1.1 FPC2.4 FPC3.4 FPC4.1 FPC5.1 H1.1 H1.2 LED3.2(-) LED5.2(-) Q1.1(ADJ/GND) Q2.1(ADJ/GND) Q3.2(E) R3.1 R15.1 R16.1 R20.2 R21.1 R23.1 R30.2 SW1.1 SW2.4 SW2.5 SW3.3 SW3.4 SW4.3 SW4.4 U1.10(VSS) U1.20(VSSA) U1.27(VSS) U1.74(VSS) U1.99(VSS) U2.3(A) U4.5 U4.6 U5.3(GND) U6.5(GND) U7.8(GND) U7.13(GND) U8.1 U9.1 U10.4(V/G) U10.5(GND) U10.6(GND) U11.2(GND) U11.8(S) U12.4(#G2A) U12.5(#G2B) U12.8(GND) USB1.1(GND) USB1.12(GND) USB1.13(SHELL) USB1.14(SHELL) USB2.1(GND) USB2.12(GND) USB2.13(SHELL) USB2.14(SHELL) X1.2(GND) X1.4(GND)
VCC_+3.3V_2: R32.2 R33.2 R34.2 R35.2 R36.2 R37.2 R38.2 R39.2 SW2.2
BACKLIGHT: R27.1 U1.92(PB6)
BACKLIGHT_ADC: C34.1 R25.1 U1.23(PA0)
BOOT0: R10.1 U1.94(BOOT0)
BOOT1: R11.1 U1.37(PB2)
CAN1_RX: U1.81(PD0) U11.4(RXD)
CAN1_TX: U1.82(PD1) U11.1(TXD)
CAN_H: CN4.1 R31.2 U11.7(CANH)
CAN_L: CN4.2 R31.1 U11.6(CANL)
CH340_RX: R5.2 R8.1 U5.7(RXD)
CH340_TX: R9.2 R12.1 U5.6(TXD)
D+: D3.1(I/O1) USB1.6(DP1) USB1.8(DP2)
D-: D3.3(I/O2) USB1.5(DN2) USB1.7(DN1)
LEDA: U1.60(PD13) U12.1(A)
LEDB: U1.61(PD14) U12.2(B)
LEDC: U1.62(PD15) U12.3(C)
M0_ADC: FPC1.11 U1.29(PA4)
M0_ADC_A: FPC1.18 U1.25(PA2)
M0_ADC_C: FPC1.17 U1.26(PA3)
M0_BK_BUTTON: C32.2 R28.2 SW3.1 SW3.2 U1.46(PE15)
M0_BK_OUT: FPC1.26 U1.2(PE3)
M0_I2C1_SCL: CN2.3 FPC2.2 U1.95(PB8)
M0_I2C1_SDA: CN2.2 FPC2.3 U1.96(PB9)
M0_SPI2_CS: FPC4.5 U1.57(PD10) U8.5
M0_SPI2_MISO: FPC4.3 U1.53(PB14) U8.3
M0_SPI2_MOSI: FPC4.2 U1.54(PB15) U8.2
M0_SPI2_SCK: FPC4.4 U1.52(PB13) U8.4
M0_TIM1_CH1: FPC1.20 U1.40(PE9)
M0_TIM1_CH1N: FPC1.19 U1.39(PE8)
M0_TIM1_CH2: FPC1.22 U1.42(PE11)
M0_TIM1_CH2N: FPC1.21 U1.41(PE10)
M0_TIM1_CH3: FPC1.24 U1.44(PE13)
M0_TIM1_CH3N: FPC1.23 U1.43(PE12)
M1_ADC: FPC1.10 U1.34(PC5)
M1_ADC_A: FPC1.9 U1.15(PC0)
M1_ADC_C: FPC1.8 U1.16(PC1)
M1_BK_BUTTON: C33.2 R29.2 SW4.1 SW4.2 U1.31(PA6)
M1_BK_OUT: FPC1.25 U1.3(PE4)
M1_I2C2_SCL: CN3.3 FPC3.2 U1.47(PB10)
M1_I2C2_SDA: CN3.2 FPC3.3 U1.48(PB11)
M1_SPI3_CS: FPC5.5 U1.77(PA15) U9.5
M1_SPI3_MISO: FPC5.3 U1.79(PC11) U9.3
M1_SPI3_MOSI: FPC5.2 U1.80(PC12) U9.2
M1_SPI3_SCK: FPC5.4 U1.78(PC10) U9.4
M1_TIM8_CH1: FPC1.3 U1.63(PC6)
M1_TIM8_CH1N: FPC1.2 U1.30(PA5)
M1_TIM8_CH2: FPC1.5 U1.64(PC7)
M1_TIM8_CH2N: FPC1.4 U1.35(PB0)
M1_TIM8_CH3: FPC1.7 U1.65(PC8)
M1_TIM8_CH3N: FPC1.6 U1.36(PB1)
MOTOR_EN1: FPC1.27 U1.4(PE5)
MOTOR_EN2: FPC1.28 U1.5(PE6)
NRST: C28.2 R14.1 SW1.2 U1.14(NRST)
OSC_IN: C12.1 U1.12(PH0) X1.1(OSC1)
OSC_OUT: C2.1 U1.13(PH1) X1.3(OSC2)
OTG_D+: R18.1 USB2.6(DP1) USB2.8(DP2)
OTG_D-: R19.1 USB2.5(DN2) USB2.7(DN1)
PA1: FPC1.16 U1.24(PA1)
PA7: FPC1.13 U1.32(PA7)
PA9: R8.2 U1.68(PA9)
PA10: R12.2 U1.69(PA10)
PA11: R19.2 U1.70(PA11)
PA12: R18.2 U1.71(PA12)
PA13: H1.5 H1.6 U1.72(PA13)
PA14: H1.3 H1.4 U1.76(PA14)
PB3: U1.89(PB3) U7.4(SCL)
PB4: U1.90(PB4) U7.5(RS)
PB5: U1.91(PB5) U7.3(SDA)
PC2: FPC1.15 U1.17(PC2)
PC3: FPC1.14 U1.18(PC3)
PC9: FPC1.12 U1.66(PC9)
PD3: U1.84(PD3) U7.6(RES)
PD4: R17.2 U1.85(PD4) U6.2(#RE) U6.3(#SHDN)
PD5: U1.86(PD5) U6.4(DI)
PD6: U1.87(PD6) U6.1(RO)
PD7: U1.88(PD7) U7.7(CS)
TEST_LED: LED4.1(K) U1.1(PE2)
USB+: D3.6(I/O1) U5.1(UD+)
USB-: D3.4(I/O2) U5.2(UD-)
USB_VCC: F1.1 USB1.2(VBUS) USB1.11(VBUS) USB2.2(VBUS) USB2.11(VBUS)
VREF: C11.2 R1.2 R2.2 R4.2 U1.21(VREF+) U2.2(K)
$1N4607: LED3.1(+) R6.1
$1N5052: C13.2 U1.73(VCAP_2)
$1N8262: R10.2 U4.3
$1N11541: C23.2 U1.49(VCAP_1)
$1N13723: C26.1 U5.8(V3)
$1N14257: R2.1 R3.2 U2.1(R)
$1N21384: Q3.1(B) R27.2 R30.1
$1N21387: R26.1 U7.12(LEDA)
$1N21388: Q3.3(C) U7.11(LEDK)
$1N24716: R25.2 U10.2(OUT)
$1N25477: CN1.3 R22.1 R24.1 U6.6(A)
$1N25478: CN1.2 R20.1 R22.2 U6.7(B)
$1N28487: R15.2 USB1.4(CC1)
$1N28620: R21.2 USB1.10(CC2)
$1N28747: R16.2 USB2.4(CC1)
$1N28749: R23.2 USB2.10(CC2)
$1N31567: D4.2(A) F1.2
$1N34636: LED2.1(K) R9.1
$1N34643: LED1.1(K) R5.1
$1N34651: LED5.1(+) R13.1
$1N41751: LED4.2(A) R7.1
$1N56661: C1.2 U1.6(VBAT)
$1N85266: C3.1 C4.2 D1.1(K) Q1.3(VIN)
$1N85309: C7.1 C8.2 D2.1(K) Q2.3(VIN)
$1N95889: D5.2(A) FPC1.29 FPC1.30
$1N102744: LED6.1 U12.15(Y0)
$1N102783: LED6.2 R32.1
$1N102997: LED7.2 R33.1
$1N103001: LED7.1 U12.14(Y1)
$1N103337: LED8.2 R34.1
$1N103341: LED8.1 U12.13(Y2)
$1N103422: LED9.2 R35.1
$1N103426: LED9.1 U12.12(Y3)
$1N103507: LED10.2 R36.1
$1N103511: LED10.1 U12.11(Y4)
$1N103592: LED11.2 R38.1
$1N103596: LED11.1 U12.10(Y5)
$1N103677: LED13.2 R39.1
$1N103681: LED13.1 U12.9(Y6)
$1N103762: LED12.2 R37.1
$1N103766: LED12.1 U12.7(Y7)
$1N129348: R11.2 U4.4

Not connected (* = marked no-connect by the designer): CN1 5* 6*; CN2 5* 6*; CN3 5* 6*; CN4 3* 4*; FPC1 31* 32*; FPC2 5* 6*; FPC3 5* 6*; FPC4 7* 8*; FPC5 7* 8*; SW2 3* 6*; U1 7(PC13)* 8(PC14)* 9(PC15)* 33(PC4)* 38(PE7)* 45(PE14)* 51(PB12)* 55(PD8)* 56(PD9)* 58(PD11)* 59(PD12)* 67(PA8)* 83(PD2)* 93(PB7)* 97(PE0)* 98(PE1)*; U5 4(RTS#)*; U7 1(NC)* 2(NC)* 9(NC)*; U8 7* 8*; U9 7* 8*; U10 3(NC)*; U11 5(VREF)*; USB1 3(SBU2)* 9(SBU1)*; USB2 3(SBU2)* 9(SBU1)*

## Notes on the sheet
- 电源1
- 电源2
- 5V-3.3V
- 5V-3.3V
- STM32F407VET6
- VREF=2.5*(1+R8/R9)
  =3.298V
- CL=(14*14)/(14+14)=7pF
- LED1
- STlink
- BOOST
- USB-串口
- USB-Slave
- RS485串口
- 复位按钮
- TFT屏幕
- 驱动板FPC
- 磁编码器FPC
- 按键
- CAN收发器
- LED2
